# Altium schematic sheet BMS Microprocessor.SchDoc
size B
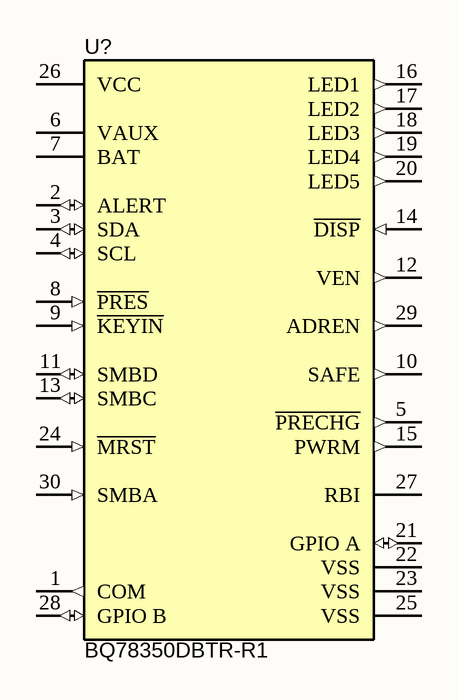
[diagram p0: BMS Microprocessor.SchDoc]

## Parts
U?  BQ78350DBTR-R1  [DBT0030A_N]

## Nets

Not connected (* = marked no-connect by the designer): U? 1(COM) 2(ALERT) 3(SDA) 4(SCL) 5(~{PRECHG}) 6(VAUX) 7(BAT) 8(~{PRES}) 9(~{KEYIN}) 10(SAFE) 11(SMBD) 12(VEN) 13(SMBC) 14(~{DISP}) 15(PWRM) 16(LED1) 17(LED2) 18(LED3) 19(LED4) 20(LED5) 21(GPIO_A) 22(VSS) 23(VSS) 24(~{MRST}) 25(VSS) 26(VCC) 27(RBI) 28(GPIO_B) 29(ADREN) 30(SMBA)

## Library data of the parts
U? = BQ78350DBTR-R1: CEDV Li-Ion Gas Gauge and Battery Management Controller Companion to the bq769x0 Battery Monitoring AFE, DBT0030A; Alternate PartNumber: BQ78350DBT-R1; Manufacturer: Texas Instruments; SymbolCreator: x0208325; CompType: IC; U/M: EA; SymbolVersion: 2013-11-18; PartNumber: BQ78350DBTR-R1; PackageReference: DBT0030A; MountType: SMT; ComponentLink1Description: Datasheet Link; ComponentLink1URL: http://www.ti.com/lit/ds/symlink/bq78350-r1.pdf; RoHS: Y; Publisher: Texas Instruments; LatestRevisionDate: 2016-04-08; Alternate Manufacturer: Texas Instruments